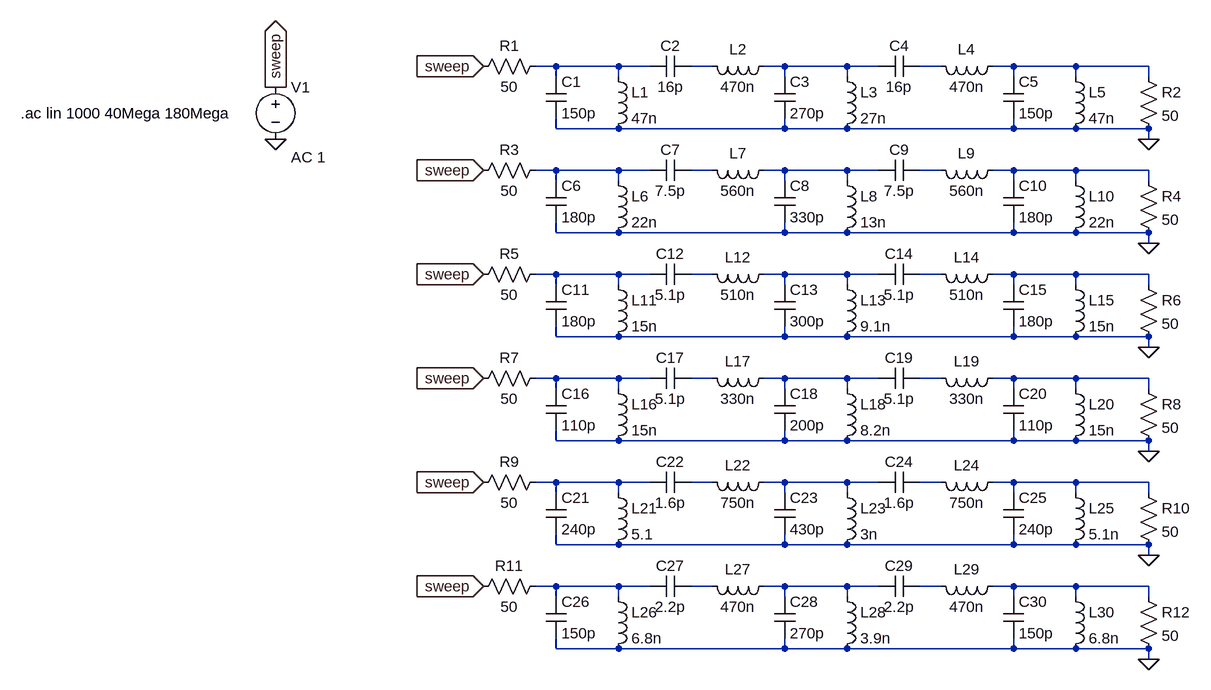
[diagram p0: schematic preselector.asc]
preselector.asc, the LTspice schematic file:
Version 4.1
SHEET 1 1492 1268
WIRE 512 64 480 64
WIRE 608 64 512 64
WIRE 656 64 608 64
WIRE 752 64 720 64
WIRE 864 64 832 64
WIRE 960 64 864 64
WIRE 1008 64 960 64
WIRE 1104 64 1072 64
WIRE 1216 64 1184 64
WIRE 1312 64 1216 64
WIRE 1424 64 1312 64
WIRE 512 80 512 64
WIRE 608 80 608 64
WIRE 864 80 864 64
WIRE 960 80 960 64
WIRE 1216 80 1216 64
WIRE 1312 80 1312 64
WIRE 1424 80 1424 64
WIRE 512 160 512 144
WIRE 608 160 512 160
WIRE 864 160 864 144
WIRE 864 160 608 160
WIRE 960 160 864 160
WIRE 1216 160 1216 144
WIRE 1216 160 960 160
WIRE 1312 160 1216 160
WIRE 1424 160 1312 160
WIRE 1424 176 1424 160
WIRE 512 224 480 224
WIRE 608 224 512 224
WIRE 656 224 608 224
WIRE 752 224 720 224
WIRE 864 224 832 224
WIRE 960 224 864 224
WIRE 1008 224 960 224
WIRE 1104 224 1072 224
WIRE 1216 224 1184 224
WIRE 1312 224 1216 224
WIRE 1424 224 1312 224
WIRE 512 240 512 224
WIRE 608 240 608 224
WIRE 864 240 864 224
WIRE 960 240 960 224
WIRE 1216 240 1216 224
WIRE 1312 240 1312 224
WIRE 1424 240 1424 224
WIRE 512 320 512 304
WIRE 608 320 512 320
WIRE 864 320 864 304
WIRE 864 320 608 320
WIRE 960 320 864 320
WIRE 1216 320 1216 304
WIRE 1216 320 960 320
WIRE 1312 320 1216 320
WIRE 1424 320 1312 320
WIRE 1424 336 1424 320
WIRE 512 384 480 384
WIRE 608 384 512 384
WIRE 656 384 608 384
WIRE 752 384 720 384
WIRE 864 384 832 384
WIRE 960 384 864 384
WIRE 1008 384 960 384
WIRE 1104 384 1072 384
WIRE 1216 384 1184 384
WIRE 1312 384 1216 384
WIRE 1424 384 1312 384
WIRE 512 400 512 384
WIRE 608 400 608 384
WIRE 864 400 864 384
WIRE 960 400 960 384
WIRE 1216 400 1216 384
WIRE 1312 400 1312 384
WIRE 1424 400 1424 384
WIRE 512 480 512 464
WIRE 608 480 512 480
WIRE 864 480 864 464
WIRE 864 480 608 480
WIRE 960 480 864 480
WIRE 1216 480 1216 464
WIRE 1216 480 960 480
WIRE 1312 480 1216 480
WIRE 1424 480 1312 480
WIRE 1424 496 1424 480
WIRE 512 544 480 544
WIRE 608 544 512 544
WIRE 656 544 608 544
WIRE 752 544 720 544
WIRE 864 544 832 544
WIRE 960 544 864 544
WIRE 1008 544 960 544
WIRE 1104 544 1072 544
WIRE 1216 544 1184 544
WIRE 1312 544 1216 544
WIRE 1424 544 1312 544
WIRE 512 560 512 544
WIRE 608 560 608 544
WIRE 864 560 864 544
WIRE 960 560 960 544
WIRE 1216 560 1216 544
WIRE 1312 560 1312 544
WIRE 1424 560 1424 544
WIRE 512 640 512 624
WIRE 608 640 512 640
WIRE 864 640 864 624
WIRE 864 640 608 640
WIRE 960 640 864 640
WIRE 1216 640 1216 624
WIRE 1216 640 960 640
WIRE 1312 640 1216 640
WIRE 1424 640 1312 640
WIRE 1424 656 1424 640
WIRE 512 704 480 704
WIRE 608 704 512 704
WIRE 656 704 608 704
WIRE 752 704 720 704
WIRE 864 704 832 704
WIRE 960 704 864 704
WIRE 1008 704 960 704
WIRE 1104 704 1072 704
WIRE 1216 704 1184 704
WIRE 1312 704 1216 704
WIRE 1424 704 1312 704
WIRE 512 720 512 704
WIRE 608 720 608 704
WIRE 864 720 864 704
WIRE 960 720 960 704
WIRE 1216 720 1216 704
WIRE 1312 720 1312 704
WIRE 1424 720 1424 704
WIRE 512 800 512 784
WIRE 608 800 512 800
WIRE 864 800 864 784
WIRE 864 800 608 800
WIRE 960 800 864 800
WIRE 1216 800 1216 784
WIRE 1216 800 960 800
WIRE 1312 800 1216 800
WIRE 1424 800 1312 800
WIRE 1424 816 1424 800
WIRE 512 864 480 864
WIRE 608 864 512 864
WIRE 656 864 608 864
WIRE 752 864 720 864
WIRE 864 864 832 864
WIRE 960 864 864 864
WIRE 1008 864 960 864
WIRE 1104 864 1072 864
WIRE 1216 864 1184 864
WIRE 1312 864 1216 864
WIRE 1424 864 1312 864
WIRE 512 880 512 864
WIRE 608 880 608 864
WIRE 864 880 864 864
WIRE 960 880 960 864
WIRE 1216 880 1216 864
WIRE 1312 880 1312 864
WIRE 1424 880 1424 864
WIRE 512 960 512 944
WIRE 608 960 512 960
WIRE 864 960 864 944
WIRE 864 960 608 960
WIRE 960 960 864 960
WIRE 1216 960 1216 944
WIRE 1216 960 960 960
WIRE 1312 960 1216 960
WIRE 1424 960 1312 960
WIRE 1424 976 1424 960
FLAG 80 176 0
FLAG 80 96 sweep
IOPIN 80 96 Out
FLAG 400 64 sweep
IOPIN 400 64 In
FLAG 1424 176 0
FLAG 400 224 sweep
IOPIN 400 224 In
FLAG 1424 336 0
FLAG 400 384 sweep
IOPIN 400 384 In
FLAG 1424 496 0
FLAG 400 544 sweep
IOPIN 400 544 In
FLAG 1424 656 0
FLAG 400 704 sweep
IOPIN 400 704 In
FLAG 1424 816 0
FLAG 400 864 sweep
IOPIN 400 864 In
FLAG 1424 976 0
SYMBOL voltage 80 80 R0
WINDOW 123 24 124 Left 2
WINDOW 39 0 0 Left 0
SYMATTR Value2 AC 1
SYMATTR InstName V1
SYMATTR Value ""
SYMBOL res 496 48 R90
WINDOW 0 0 56 VBottom 2
WINDOW 3 32 56 VTop 2
SYMATTR InstName R1
SYMATTR Value 50
SYMBOL cap 496 80 R0
SYMATTR InstName C1
SYMATTR Value 150p
SYMBOL ind 592 64 R0
SYMATTR InstName L1
SYMATTR Value 47n
SYMATTR SpiceLine Rser=1m
SYMBOL cap 720 48 R90
WINDOW 0 0 32 VBottom 2
WINDOW 3 32 32 VTop 2
SYMATTR InstName C2
SYMATTR Value 16p
SYMBOL ind 848 48 R90
WINDOW 0 5 56 VBottom 2
WINDOW 3 32 56 VTop 2
SYMATTR InstName L2
SYMATTR Value 470n
SYMATTR SpiceLine Rser=1m
SYMBOL cap 848 80 R0
SYMATTR InstName C3
SYMATTR Value 270p
SYMBOL ind 944 64 R0
SYMATTR InstName L3
SYMATTR Value 27n
SYMATTR SpiceLine Rser=1m
SYMBOL cap 1072 48 R90
WINDOW 0 0 32 VBottom 2
WINDOW 3 32 32 VTop 2
SYMATTR InstName C4
SYMATTR Value 16p
SYMBOL ind 1200 48 R90
WINDOW 0 5 56 VBottom 2
WINDOW 3 32 56 VTop 2
SYMATTR InstName L4
SYMATTR Value 470n
SYMATTR SpiceLine Rser=1m
SYMBOL cap 1200 80 R0
SYMATTR InstName C5
SYMATTR Value 150p
SYMBOL ind 1296 64 R0
SYMATTR InstName L5
SYMATTR Value 47n
SYMATTR SpiceLine Rser=1m
SYMBOL res 1408 64 R0
SYMATTR InstName R2
SYMATTR Value 50
SYMBOL res 496 208 R90
WINDOW 0 0 56 VBottom 2
WINDOW 3 32 56 VTop 2
SYMATTR InstName R3
SYMATTR Value 50
SYMBOL cap 496 240 R0
SYMATTR InstName C6
SYMATTR Value 180p
SYMBOL ind 592 224 R0
SYMATTR InstName L6
SYMATTR Value 22n
SYMATTR SpiceLine Rser=1m
SYMBOL cap 720 208 R90
WINDOW 0 0 32 VBottom 2
WINDOW 3 32 32 VTop 2
SYMATTR InstName C7
SYMATTR Value 7.5p
SYMBOL ind 848 208 R90
WINDOW 0 5 56 VBottom 2
WINDOW 3 32 56 VTop 2
SYMATTR InstName L7
SYMATTR Value 560n
SYMATTR SpiceLine Rser=1m
SYMBOL cap 848 240 R0
SYMATTR InstName C8
SYMATTR Value 330p
SYMBOL ind 944 224 R0
SYMATTR InstName L8
SYMATTR Value 13n
SYMATTR SpiceLine Rser=1m
SYMBOL cap 1072 208 R90
WINDOW 0 0 32 VBottom 2
WINDOW 3 32 32 VTop 2
SYMATTR InstName C9
SYMATTR Value 7.5p
SYMBOL ind 1200 208 R90
WINDOW 0 5 56 VBottom 2
WINDOW 3 32 56 VTop 2
SYMATTR InstName L9
SYMATTR Value 560n
SYMATTR SpiceLine Rser=1m
SYMBOL cap 1200 240 R0
SYMATTR InstName C10
SYMATTR Value 180p
SYMBOL ind 1296 224 R0
SYMATTR InstName L10
SYMATTR Value 22n
SYMATTR SpiceLine Rser=1m
SYMBOL res 1408 224 R0
SYMATTR InstName R4
SYMATTR Value 50
SYMBOL res 496 368 R90
WINDOW 0 0 56 VBottom 2
WINDOW 3 32 56 VTop 2
SYMATTR InstName R5
SYMATTR Value 50
SYMBOL cap 496 400 R0
SYMATTR InstName C11
SYMATTR Value 180p
SYMBOL ind 592 384 R0
SYMATTR InstName L11
SYMATTR Value 15n
SYMATTR SpiceLine Rser=1m
SYMBOL cap 720 368 R90
WINDOW 0 0 32 VBottom 2
WINDOW 3 32 32 VTop 2
SYMATTR InstName C12
SYMATTR Value 5.1p
SYMBOL ind 848 368 R90
WINDOW 0 5 56 VBottom 2
WINDOW 3 32 56 VTop 2
SYMATTR InstName L12
SYMATTR Value 510n
SYMATTR SpiceLine Rser=1m
SYMBOL cap 848 400 R0
SYMATTR InstName C13
SYMATTR Value 300p
SYMBOL ind 944 384 R0
SYMATTR InstName L13
SYMATTR Value 9.1n
SYMATTR SpiceLine Rser=1m
SYMBOL cap 1072 368 R90
WINDOW 0 0 32 VBottom 2
WINDOW 3 32 32 VTop 2
SYMATTR InstName C14
SYMATTR Value 5.1p
SYMBOL ind 1200 368 R90
WINDOW 0 5 56 VBottom 2
WINDOW 3 32 56 VTop 2
SYMATTR InstName L14
SYMATTR Value 510n
SYMATTR SpiceLine Rser=1m
SYMBOL cap 1200 400 R0
SYMATTR InstName C15
SYMATTR Value 180p
SYMBOL ind 1296 384 R0
SYMATTR InstName L15
SYMATTR Value 15n
SYMATTR SpiceLine Rser=1m
SYMBOL res 1408 384 R0
SYMATTR InstName R6
SYMATTR Value 50
SYMBOL res 496 528 R90
WINDOW 0 0 56 VBottom 2
WINDOW 3 32 56 VTop 2
SYMATTR InstName R7
SYMATTR Value 50
SYMBOL cap 496 560 R0
SYMATTR InstName C16
SYMATTR Value 110p
SYMBOL ind 592 544 R0
SYMATTR InstName L16
SYMATTR Value 15n
SYMATTR SpiceLine Rser=1m
SYMBOL cap 720 528 R90
WINDOW 0 0 32 VBottom 2
WINDOW 3 32 32 VTop 2
SYMATTR InstName C17
SYMATTR Value 5.1p
SYMBOL ind 848 528 R90
WINDOW 0 5 56 VBottom 2
WINDOW 3 32 56 VTop 2
SYMATTR InstName L17
SYMATTR Value 330n
SYMATTR SpiceLine Rser=1m
SYMBOL cap 848 560 R0
SYMATTR InstName C18
SYMATTR Value 200p
SYMBOL ind 944 544 R0
SYMATTR InstName L18
SYMATTR Value 8.2n
SYMATTR SpiceLine Rser=1m
SYMBOL cap 1072 528 R90
WINDOW 0 0 32 VBottom 2
WINDOW 3 32 32 VTop 2
SYMATTR InstName C19
SYMATTR Value 5.1p
SYMBOL ind 1200 528 R90
WINDOW 0 5 56 VBottom 2
WINDOW 3 32 56 VTop 2
SYMATTR InstName L19
SYMATTR Value 330n
SYMATTR SpiceLine Rser=1m
SYMBOL cap 1200 560 R0
SYMATTR InstName C20
SYMATTR Value 110p
SYMBOL ind 1296 544 R0
SYMATTR InstName L20
SYMATTR Value 15n
SYMATTR SpiceLine Rser=1m
SYMBOL res 1408 544 R0
SYMATTR InstName R8
SYMATTR Value 50
SYMBOL res 496 688 R90
WINDOW 0 0 56 VBottom 2
WINDOW 3 32 56 VTop 2
SYMATTR InstName R9
SYMATTR Value 50
SYMBOL cap 496 720 R0
SYMATTR InstName C21
SYMATTR Value 240p
SYMBOL ind 592 704 R0
SYMATTR InstName L21
SYMATTR Value 5.1
SYMATTR SpiceLine Rser=1m
SYMBOL cap 720 688 R90
WINDOW 0 0 32 VBottom 2
WINDOW 3 32 32 VTop 2
SYMATTR InstName C22
SYMATTR Value 1.6p
SYMBOL ind 848 688 R90
WINDOW 0 5 56 VBottom 2
WINDOW 3 32 56 VTop 2
SYMATTR InstName L22
SYMATTR Value 750n
SYMATTR SpiceLine Rser=1m
SYMBOL cap 848 720 R0
SYMATTR InstName C23
SYMATTR Value 430p
SYMBOL ind 944 704 R0
SYMATTR InstName L23
SYMATTR Value 3n
SYMATTR SpiceLine Rser=1m
SYMBOL cap 1072 688 R90
WINDOW 0 0 32 VBottom 2
WINDOW 3 32 32 VTop 2
SYMATTR InstName C24
SYMATTR Value 1.6p
SYMBOL ind 1200 688 R90
WINDOW 0 5 56 VBottom 2
WINDOW 3 32 56 VTop 2
SYMATTR InstName L24
SYMATTR Value 750n
SYMATTR SpiceLine Rser=1m
SYMBOL cap 1200 720 R0
SYMATTR InstName C25
SYMATTR Value 240p
SYMBOL ind 1296 704 R0
SYMATTR InstName L25
SYMATTR Value 5.1n
SYMATTR SpiceLine Rser=1m
SYMBOL res 1408 704 R0
SYMATTR InstName R10
SYMATTR Value 50
SYMBOL res 496 848 R90
WINDOW 0 0 56 VBottom 2
WINDOW 3 32 56 VTop 2
SYMATTR InstName R11
SYMATTR Value 50
SYMBOL cap 496 880 R0
SYMATTR InstName C26
SYMATTR Value 150p
SYMBOL ind 592 864 R0
SYMATTR InstName L26
SYMATTR Value 6.8n
SYMATTR SpiceLine Rser=1m
SYMBOL cap 720 848 R90
WINDOW 0 0 32 VBottom 2
WINDOW 3 32 32 VTop 2
SYMATTR InstName C27
SYMATTR Value 2.2p
SYMBOL ind 848 848 R90
WINDOW 0 5 56 VBottom 2
WINDOW 3 32 56 VTop 2
SYMATTR InstName L27
SYMATTR Value 470n
SYMATTR SpiceLine Rser=1m
SYMBOL cap 848 880 R0
SYMATTR InstName C28
SYMATTR Value 270p
SYMBOL ind 944 864 R0
SYMATTR InstName L28
SYMATTR Value 3.9n
SYMATTR SpiceLine Rser=1m
SYMBOL cap 1072 848 R90
WINDOW 0 0 32 VBottom 2
WINDOW 3 32 32 VTop 2
SYMATTR InstName C29
SYMATTR Value 2.2p
SYMBOL ind 1200 848 R90
WINDOW 0 5 56 VBottom 2
WINDOW 3 32 56 VTop 2
SYMATTR InstName L29
SYMATTR Value 470n
SYMATTR SpiceLine Rser=1m
SYMBOL cap 1200 880 R0
SYMATTR InstName C30
SYMATTR Value 150p
SYMBOL ind 1296 864 R0
SYMATTR InstName L30
SYMATTR Value 6.8n
SYMATTR SpiceLine Rser=1m
SYMBOL res 1408 864 R0
SYMATTR InstName R12
SYMATTR Value 50
TEXT -312 136 Left 2 !.ac lin 1000 40Mega 180Mega

The netlist it stands for:
* preselector.asc
V1 sweep 0 AC 1
R1 N001 sweep 50
C1 N001 0 150p
L1 N001 0 47n Rser=1m
C2 N002 N001 16p
L2 N003 N002 470n Rser=1m
C3 N003 0 270p
L3 N003 0 27n Rser=1m
C4 N004 N003 16p
L4 N005 N004 470n Rser=1m
C5 N005 0 150p
L5 N005 0 47n Rser=1m
R2 N005 0 50
R3 N006 sweep 50
C6 N006 0 180p
L6 N006 0 22n Rser=1m
C7 N007 N006 7.5p
L7 N008 N007 560n Rser=1m
C8 N008 0 330p
L8 N008 0 13n Rser=1m
C9 N009 N008 7.5p
L9 N010 N009 560n Rser=1m
C10 N010 0 180p
L10 N010 0 22n Rser=1m
R4 N010 0 50
R5 N011 sweep 50
C11 N011 0 180p
L11 N011 0 15n Rser=1m
C12 N012 N011 5.1p
L12 N013 N012 510n Rser=1m
C13 N013 0 300p
L13 N013 0 9.1n Rser=1m
C14 N014 N013 5.1p
L14 N015 N014 510n Rser=1m
C15 N015 0 180p
L15 N015 0 15n Rser=1m
R6 N015 0 50
R7 N016 sweep 50
C16 N016 0 110p
L16 N016 0 15n Rser=1m
C17 N017 N016 5.1p
L17 N018 N017 330n Rser=1m
C18 N018 0 200p
L18 N018 0 8.2n Rser=1m
C19 N019 N018 5.1p
L19 N020 N019 330n Rser=1m
C20 N020 0 110p
L20 N020 0 15n Rser=1m
R8 N020 0 50
R9 N021 sweep 50
C21 N021 0 240p
L21 N021 0 5.1 Rser=1m
C22 N022 N021 1.6p
L22 N023 N022 750n Rser=1m
C23 N023 0 430p
L23 N023 0 3n Rser=1m
C24 N024 N023 1.6p
L24 N025 N024 750n Rser=1m
C25 N025 0 240p
L25 N025 0 5.1n Rser=1m
R10 N025 0 50
R11 N026 sweep 50
C26 N026 0 150p
L26 N026 0 6.8n Rser=1m
C27 N027 N026 2.2p
L27 N028 N027 470n Rser=1m
C28 N028 0 270p
L28 N028 0 3.9n Rser=1m
C29 N029 N028 2.2p
L29 N030 N029 470n Rser=1m
C30 N030 0 150p
L30 N030 0 6.8n Rser=1m
R12 N030 0 50
.ac lin 1000 40Mega 180Mega
.backanno
.end